# Altium project PCB_Project.PrjPcb
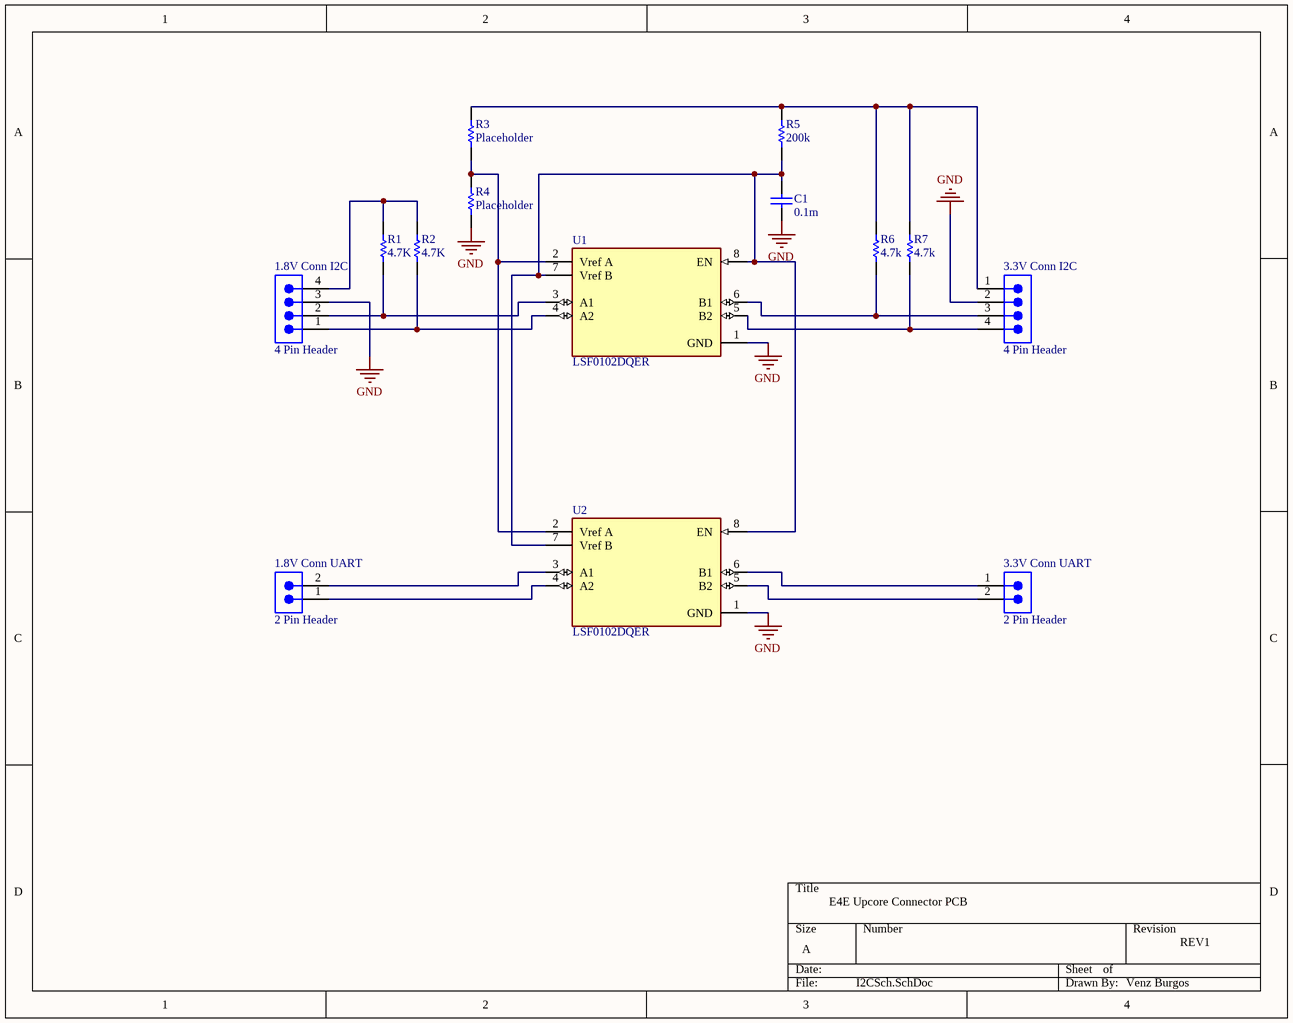
[diagram p0: I2CSch.SchDoc]
1 sheet, 14 parts. Net scope: global (net labels, ports and power ports of the same name join across sheets).

## Sheet I2CSch.SchDoc
size A; SheetNumber: 1; SheetTotal: 1

### Parts
1.8V_Conn_I2C  4 Pin Header  [61300411121]
1.8V_Conn_UART  2 Pin Header  [61300211121]
3.3V_Conn_I2C  4 Pin Header  [61300411121]
3.3V_Conn_UART  2 Pin Header  [61300211121]
C1  value 0.1m  (hidden comment: Capacitor)
R1  value 4.7K  (hidden comment: Resistor)
R2  value 4.7K  (hidden comment: Resistor)
R3  value Placeholder  (hidden comment: Resistor)
R4  value Placeholder  (hidden comment: Resistor)
R5  value 200k  (hidden comment: Resistor)
R6  value 4.7k  (hidden comment: Resistor)
R7  value 4.7k  (hidden comment: Resistor)
U1  LSF0102DQER  [FP-DQE0008A-MFG]
U2  LSF0102DQER  [FP-DQE0008A-MFG]

### Nets
GND: 1.8V_Conn_I2C.3 3.3V_Conn_I2C.2 C1.1 R4.1 U1.1(GND) U2.1(GND)
Net1.8V_Conn_I2C_1: 1.8V_Conn_I2C.1 R2.1 U1.4(A2)
Net1.8V_Conn_I2C_2: 1.8V_Conn_I2C.2 R1.1 U1.3(A1)
Net1.8V_Conn_I2C_4: 1.8V_Conn_I2C.4 R1.2 R2.2
Net1.8V_Conn_UART_1: 1.8V_Conn_UART.1 U2.4(A2)
Net1.8V_Conn_UART_2: 1.8V_Conn_UART.2 U2.3(A1)
Net3.3V_Conn_I2C_1: 3.3V_Conn_I2C.1 R3.2 R5.2 R6.2 R7.2
Net3.3V_Conn_I2C_3: 3.3V_Conn_I2C.3 R6.1 U1.6(B1)
Net3.3V_Conn_I2C_4: 3.3V_Conn_I2C.4 R7.1 U1.5(B2)
Net3.3V_Conn_UART_1: 3.3V_Conn_UART.1 U2.6(B1)
Net3.3V_Conn_UART_2: 3.3V_Conn_UART.2 U2.5(B2)
NetC1_2: C1.2 R5.1 U1.7(Vref_B) U1.8(EN) U2.7(Vref_B) U2.8(EN)
NetR3_1: R3.1 R4.2 U1.2(Vref_A) U2.2(Vref_A)

### Notes on the sheet
- E4E Upcore Connector PCB
- REV1
- Venz Burgos

### Library data of the parts
1.8V_Conn_I2C 3.3V_Conn_I2C = CMP-1502-01064-2: NexarPartId: 32855522; Pitch: 2.54mm; Number of Contacts: 4; Contact Resistance: 20mΩ; Gender: Male; Current Rating: 3A; Connector Type: Male Pin; Voltage Rating: 250V; Lead Free: Lead Free; Contact Plating: Gold; Max Operating Temperature: 105°C; Packaging: Bulk; Height: 8.89mm; Orientation: Vertical; Contact Mating Length: 5.9944mm; Contact Material: Copper; Lead Pitch: 2.54mm; Min Operating Temperature: -40°C; Termination: Solder; Color: Black; Number of Rows: 1; REACH SVHC: Unknown; RoHS: Compliant; Mount: Through Hole; Number of Positions: 4; Number of Pins: 4; Operating Supply Voltage: 250V
1.8V_Conn_UART 3.3V_Conn_UART = CMP-1712-00002-5: NexarPartId: 20081794; Operating Supply Voltage: 250V; Current Rating: 3A; Gender: Male; Number of Contacts: 2; Pitch: 2.54mm; Connector Type: Male Pin; Contact Resistance: 20mΩ; Contact Plating: Gold; Contact Material: Copper; Number of Pins: 2; Min Operating Temperature: -40°C; Packaging: Bulk; Lead Pitch: 2.54mm; Mount: Through Hole; Orientation: Vertical; RoHS: Compliant; REACH SVHC: No SVHC; Height: 8.94mm; Termination: Through Hole; Number of Positions: 2; Contact Mating Length: 5.9944mm; Color: Black; Contact Gender: Male; Number of Rows: 1; Housing Material: PBT; Lead Free: Lead Free; Voltage Rating: 250V; Max Operating Temperature: 125°C
C1 = Capacitor: SimulationGenericComponent: True
R1-R7 = Resistor: TC1: 0; SimulationGenericComponent: True; TC2: 0
U1 U2 = CMP-04899-000086-1: IC TRNSLTR BIDIRECTIONAL 8X2SON; Max Supply Voltage: 5V; Number of Bits: 2; Min Supply Voltage: 0uV; Propagation Delay: 1.3ns; Data Rate: 200Mbps; Low Level Output Current: 64mA; Logic Function: Translator; Turn-On Delay Time: 1.5ns; Number of Circuits: 1; Channel Type: Bidirectional; Radiation Hardening: No; Lead Free: Lead Free; Max Operating Temperature: 125°C; Mount: Surface Mount; Package Quantity: 5000; High Level Output Current: 64mA; RoHS Compliant: Yes; Packaging: Tape and Reel; Number of Pins: 8; Min Operating Temperature: -40°C